# EAGLE schematic TERRA-v1 (EAGLE 9.6.2)
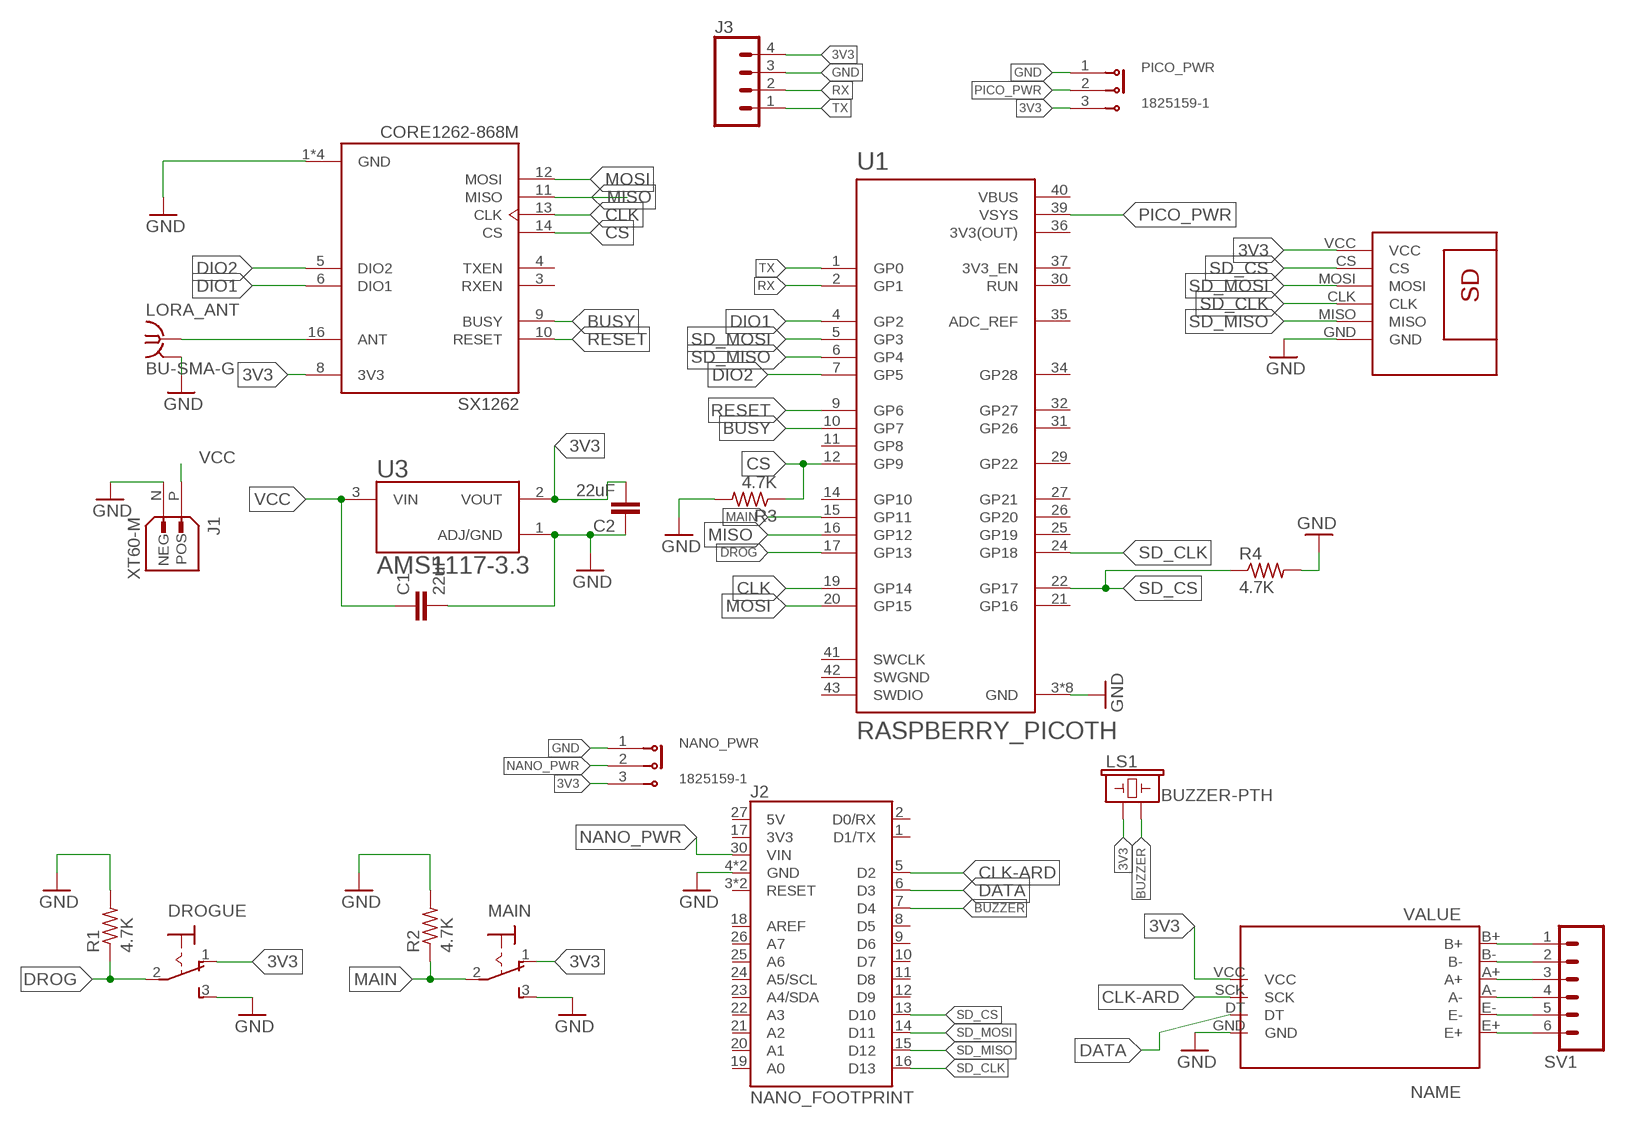
[diagram p0: schematic, sheet 1]

## Parts
C1  22uF  22UF-0805-6.3V-20%  [0805]
C2  22uF  22UF-0805-6.3V-20%  [0805]
DROGUE  M9040P  [M9040P]
HX711  HX711  HX711A  [HX711]
J1  XT60-M  [AMASS_XT60-M]
J2  NANO_FOOTPRINT  [NANO]
J3  CONN_04PTH  [1X04]
LORA_ANT  BU-SMA-G  [BU-SMA-G]
LS1  BUZZER-PTH  [BUZZER-12MM]
MAIN  M9040P  [M9040P]
NANO_PWR  1825159-1  [SW_1825159-1]
PICO_PWR  1825159-1  [SW_1825159-1]
R1  4.7K  R-US_R0805  [R0805]
R2  4.7K  R-US_R0805  [R0805]
R3  4.7K  R-US_R0805  [R0805]
R4  4.7K  R-US_R0805  [R0805]
SV1  CONN_06SILK_FEMALE_PTH  [1X06]
SX1262  CORE1262-868M  [XCVR_CORE1262-868M]
U1  RASPBERRY_PICOTH  [PICO-PKG-TH]
U3  AMS1117-3.3  [SOT229P700X180-4N]
U$1  SDREADER  [SDREADER]

## Nets
3V3: C2.2 DROGUE.1(O) HX711.VCC J3.4 LS1.+ MAIN.1(O) NANO_PWR.3 PICO_PWR.3 SX1262.8(3V3) U3.2(VOUT) U$1.VCC
BUSY: SX1262.9(BUSY) U1.10(GP7)
BUZZER: J2.7(D4) LS1.-
CLK: SX1262.13(CLK) U1.19(GP14)
CLK-ARD: HX711.SCK J2.5(D2)
CS: R3.1 SX1262.14(CS) U1.12(GP9)
DATA: HX711.DT J2.6(D3)
DIO1: SX1262.6(DIO1) U1.4(GP2)
DIO2: SX1262.5(DIO2) U1.7(GP5)
DROG: DROGUE.2(P) R1.1 U1.17(GP13)
GND: C1.2 C2.1 DROGUE.3(S) HX711.GND J1.N(NEG) J2.4(GND) J2.29(GND) J3.3 LORA_ANT.2 LORA_ANT.3 LORA_ANT.4 LORA_ANT.5 MAIN.3(S) NANO_PWR.1 PICO_PWR.1 R1.2 R2.2 R3.2 R4.2 SX1262.1(GND) SX1262.2(GND) SX1262.7(GND) SX1262.15(GND) U1.3(GND) U1.8(GND) U1.13(GND) U1.18(GND) U1.23(GND) U1.28(GND) U1.33(GND) U1.38(GND) U3.1(ADJ/GND) U$1.GND
MAIN: MAIN.2(P) R2.1 U1.15(GP11)
MISO: SX1262.11(MISO) U1.16(GP12)
MOSI: SX1262.12(MOSI) U1.20(GP15)
N$1: LORA_ANT.1 SX1262.16(ANT)
N$2: HX711.B+ SV1.1
N$3: HX711.B- SV1.2
N$4: HX711.A+ SV1.3
N$5: HX711.A- SV1.4
N$6: HX711.E- SV1.5
N$7: HX711.E+ SV1.6
NANO_PWR: J2.30(VIN) NANO_PWR.2
PICO_PWR: PICO_PWR.2 U1.39(VSYS)
RESET: SX1262.10(RESET) U1.9(GP6)
RX: J3.2 U1.2(GP1)
SD_CLK: J2.16(D13) U1.24(GP18) U$1.CLK
SD_CS: J2.13(D10) R4.1 U1.22(GP17) U$1.CS
SD_MISO: J2.15(D12) U1.6(GP4) U$1.MISO
SD_MOSI: J2.14(D11) U1.5(GP3) U$1.MOSI
TX: J3.1 U1.1(GP0)
VCC: C1.1 J1.P(POS) U3.3(VIN)
Unconnected: J2.1(D1/TX) J2.2(D0/RX) J2.3(RESET) J2.8(D5) J2.9(D6) J2.10(D7) J2.11(D8) J2.12(D9) J2.17(3V3) J2.18(AREF) J2.19(A0) J2.20(A1) J2.21(A2) J2.22(A3) J2.23(A4/SDA) J2.24(A5/SCL) J2.25(A6) J2.26(A7) J2.27(5V) J2.28(RESET) SX1262.3(RXEN) SX1262.4(TXEN) U1.11(GP8) U1.14(GP10) U1.21(GP16) U1.25(GP19) U1.26(GP20) U1.27(GP21) U1.29(GP22) U1.30(RUN) U1.31(GP26) U1.32(GP27) U1.34(GP28) U1.35(ADC_REF) U1.37(3V3_EN) U1.41(SWCLK) U1.43(SWDIO)

## Power pins joined to a net without a drawn wire
3V3(OUT): U1.36(3V3(OUT))
SWGND: U1.42(SWGND)
VBUS: U1.40(VBUS)

## Library data of the parts
C1 C2 = SparkFun-Capacitors:22UF: 22µF ceramic capacitors A capacitor is a passive two-terminal electrical component used to store electrical energy temporarily in an electric field.; PROD_ID: CAP-08402
DROGUE MAIN = switch:M9040P: TOGGLE SWITCH Marquardt
HX711 = HX711:HX711
J1 = XT60-M:XT60-M: Check availability <https://pricing.snapeda.com/parts/XT60-M/AMASS/view-part?ref=eda>; AVAILABILITY: Not in stock; DESCRIPTION: Plug; DC supply; XT60; male; PIN: 2; for cable; soldered; 30A; 500V; MF: AMASS; MP: XT60-M; PACKAGE: Package; PRICE: None
J2 = SparkFun-Boards:NANO_FOOTPRINT: Generic Nano Footprint
J3 = SparkFun-Connectors:CONN_04: Multi connection point. Often used as Generic Header-pin footprint for 0.1 inch spaced/style header connections On any of the 0.1 inch spaced packages, you can populate with these: Break Away Headers - Straight <https://www.sparkfun.com/products/116> (PRT-00116) Break Away Male Headers - Right Angle <https://www.sparkfun.com/products/553> (PRT-00553) Female Headers <https://www.sparkfun.com/products/115> (PRT-00115) Break Away Headers - Machine Pin <https://www.sparkfun.com/products/117> (PRT-00117) Break Away Female Headers - Swiss Machine Pin <https://www.sparkfun.com/products/743> (PRT-00743) For SCREWTERMINALS and SPRING TERMINALS visit here: Screw Terimnals on SparkFun.com <https://www.sparkfun.com/search/results?term=Screw+Terminals> (5mm/3.5mm/2.54mm spacing) This device is also useful as a general connection point to wire up your design to another part of your project. Our various solder wires solder well into these plated through hole pads. Hook-Up Wire - Assortment (Stranded, 22 AWG) <https://www.sparkfun.com/products/11375> (PRT-11375) Hook-Up Wire - Assortment (Solid Core, 22 AWG) <https://www.sparkfun.com/products/11367> (PRT-11367) View the entire wire category on our website here <https://www.sparkfun.com/categories/141> Special notes: Molex polarized connector foot print use with SKU : PRT-08231 with associated crimp pins and housings. 1MM SMD Version SKU: PRT-10208; PROD_ID: CONN-09696
LORA_ANT = con-coax:BU-SMA-G: FEMALE SMA CONNECTOR Radiall distributor RS 193-9117; OC_FARNELL: unknown; OC_NEWARK: unknown
LS1 = SparkFun-Electromechanical:BUZZER: Buzzer Small round buzzers that operate around the audible 2kHz range. You can use these as speakers to create simple music or user interfaces. Variant Overview: PTH - Mini Speaker - PC Mount 12mm 2.048kHz <https://www.sparkfun.com/products/7950> PTH_KIT - Mini Speaker - PC Mount 12mm 2.048kHz <https://www.sparkfun.com/products/7950> KIT simplifies soldering by adding stop mask to one side of the pads. PTH_NO_SILK - Mini Speaker - PC Mount 12mm 2.048kHz <https://www.sparkfun.com/products/7950> No silkscreen indicator of buzzer outline. PTH_KIT_NO_SILK - Mini Speaker - PC Mount 12mm 2.048kHz <https://www.sparkfun.com/products/7950> KIT package w/o silkscreen SMD - Buzzer Audio Magnetic (CCV-084B16) SMD buzzer used on, e.g. the LilyPad Buzzer <https://www.sparkfun.com/products/8463> and RFID USB Reader <https://www.sparkfun.com/products/9963>. SMD_KIT - Buzzer Audio Magnetic (CCV-084B16) SMD Buzzer with elongated pins to make soldering easier. Used on the SparkFun Simon Says - Surface Mount Soldering Kit <https://www.sparkfun.com/products/10935>. SMD-SQUARE - Buzzer Audio Magnetic (COMP-15701) SMT square buzzer with one chamfered corner.; PROD_ID: COMP-08253; SF_SKU: COM-07950
NANO_PWR PICO_PWR = 1825159-1:1825159-1: SWITCH SLIDE SPDT 300MA 125V Check availability <https://pricing.snapeda.com/parts/1825159-1/TE%20Connectivity/view-part?ref=eda>; AVAILABILITY: In Stock; COMMENT: 1825159-1; CONFIGURATION_POLE-THROW: Single Pole - Double Throw; CONTACT_CURRENT_RATING: .25 A; DESCRIPTION: Slide Switch SPDT Through Hole; EU_ROHS_COMPLIANCE: Compliant; MF: TE Connectivity; MP: 1825159-1; PACKAGE: None; PRICE: None; PURCHASE-URL: https://pricing.snapeda.com/search/part/1825159-1/?ref=eda; SWITCH_TYPE: Slide
R1-R4 = rcl:R-US_: RESISTOR, American symbol; SPICEPREFIX: R
SV1 = SparkFun-Connectors:CONN_06: Multi connection point. Often used as Generic Header-pin footprint for 0.1 inch spaced/style header connections On any of the 0.1 inch spaced packages, you can populate with these: Break Away Headers - Straight <https://www.sparkfun.com/products/116> (PRT-00116) Break Away Male Headers - Right Angle <https://www.sparkfun.com/products/553> (PRT-00553) Female Headers <https://www.sparkfun.com/products/115> (PRT-00115) Break Away Headers - Machine Pin <https://www.sparkfun.com/products/117> (PRT-00117) Break Away Female Headers - Swiss Machine Pin <https://www.sparkfun.com/products/743> (PRT-00743) Arduino Stackable Header - 6 Pin <https://www.sparkfun.com/products/9280> (PRT-09280) For SCREWTERMINALS and SPRING TERMINALS visit here: Screw Terimnals on SparkFun.com <https://www.sparkfun.com/search/results?term=Screw+Terminals> (5mm/3.5mm/2.54mm spacing) This device is also useful as a general connection point to wire up your design to another part of your project. Our various solder wires solder well into these plated through hole pads. Hook-Up Wire - Assortment (Stranded, 22 AWG) <https://www.sparkfun.com/products/11375> (PRT-11375) Hook-Up Wire - Assortment (Solid Core, 22 AWG) <https://www.sparkfun.com/products/11367> (PRT-11367) View the entire wire category on our website here <https://www.sparkfun.com/categories/141>; PROD_ID: CONN-08437
SX1262 = CORE1262-868M:CORE1262-868M: Check availability <https://pricing.snapeda.com/parts/Core1262-868M/Waveshare%20Electronics/view-part?ref=eda>; AVAILABILITY: Not in stock; DESCRIPTION: Lora core module; MF: Waveshare Electronics; MP: Core1262-868M; PACKAGE: Package; PRICE: None
U1 = RpiPico:RASPBERRY_PICO: Raspberry Pi Pico
U3 = AMS1117-3.3:AMS1117-3.3: Sot223/Pkg 1-Amp 3.3-Volt Low Drop Out Voltage Regulatator Check availability <https://pricing.snapeda.com/parts/AMS1117-3.3/Advanced%20Monolithic%20Systems/view-part?ref=eda>; AVAILABILITY: Not in stock; DESCRIPTION: Sot223/Pkg 1-Amp 3.3-Volt Low Drop Out Voltage Regulatator; MF: Advanced Monolithic Systems; MP: AMS1117-3.3; PACKAGE: SOT-223 Seeed Technology; PRICE: None
U$1 = SDREADER:SDREADER